# Altium schematic sheet P07 PHY 2.SchDoc
size 420 x 297 mm
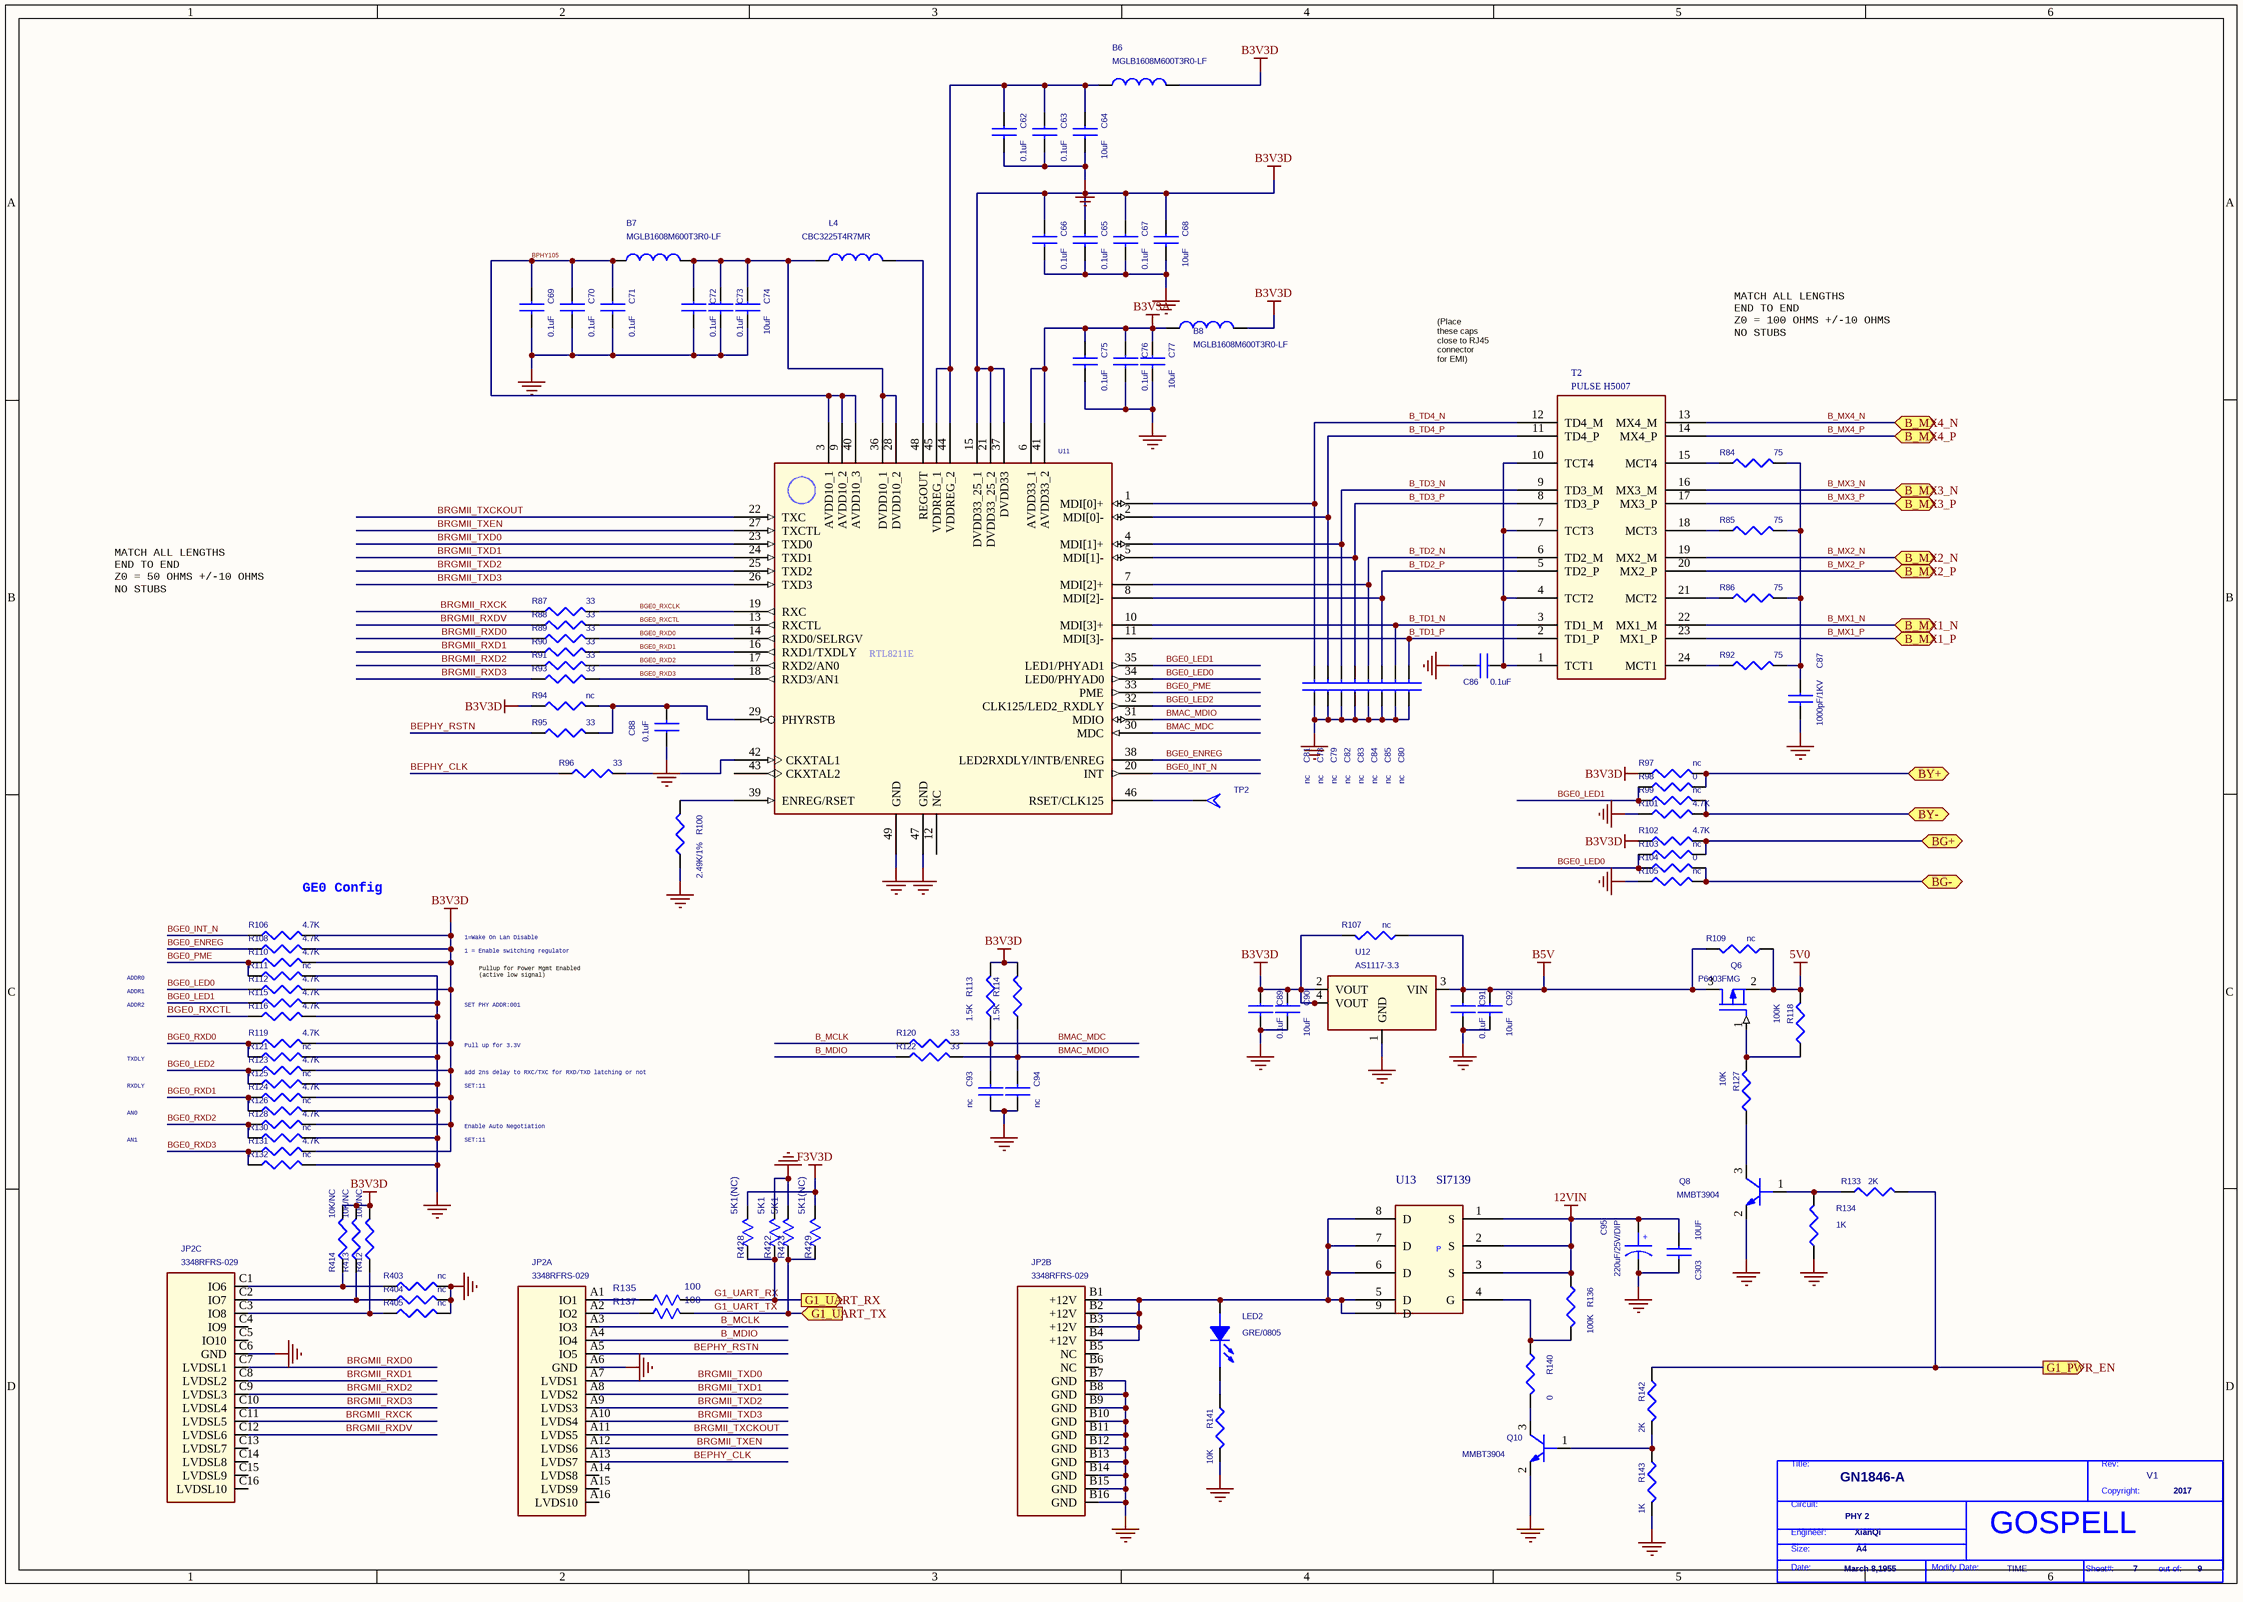
[diagram p0: P07 PHY 2.SchDoc]

## Parts
*  Doc: PHY 2  Page Count: 9  Page Number: 7  Page Create Date: March 8,1955  Page Size: A4  RevCode: V1  Title: GN1846-A  Copyright: 2017  Engineer: XianQi  Page Modify Date: TIME  (hidden comment: GOSPELL)  (graphical)
B6  MGLB1608M600T3R0-LF  [L0603]
B7  MGLB1608M600T3R0-LF  [L0603]
B8  MGLB1608M600T3R0-LF  [L0603]
C62  0.1uF  [0402C]
C63  0.1uF  [0402C]
C64  10uF  [C0603]
C65  0.1uF  [0402C]
C66  0.1uF  [0402C]
C67  0.1uF  [0402C]
C68  10uF  [C0603]
C69  0.1uF  [0402C]
C70  0.1uF  [0402C]
C71  0.1uF  [0402C]
C72  0.1uF  [0402C]
C73  0.1uF  [0402C]
C74  10uF  [C0603]
C75  0.1uF  [0402C]
C76  0.1uF  [0402C]
C77  10uF  [C0603]
C78  nc  [0402C]
C79  nc  [0402C]
C80  nc  [0402C]
C81  nc  [0402C]
C82  nc  [0402C]
C83  nc  [0402C]
C84  nc  [0402C]
C85  nc  [0402C]
C86  0.1uF  [0402C]
C87  1000pF/1KV  [C1206]
C88  0.1uF  [0402C]
C89  0.1uF  [0402C]
C90  10uF  [C0603]
C91  0.1uF  [0402C]
C92  10uF  [C0603]
C93  nc  [0402C]
C94  nc  [0402C]
C95  220uF/25V/DIP  [CE8X3.5]
C303  10UF  [C1206]
JP2  3348RFRS-029  [3348RFRS-029]  (parts A,B,C of 3)
L4  CBC3225T4R7MR  [FB0805]
LED2  GRE/0805  [LED0805]
Q6  P6403FMG  [SOT23]
Q8  MMBT3904  [SOT23]
Q10  MMBT3904  [SOT23]
R84  75  [0402R]
R85  75  [0402R]
R86  75  [0402R]
R87  33  [0402R]
R88  33  [0402R]
R89  33  [0402R]
R90  33  [0402R]
R91  33  [0402R]
R92  75  [0402R]
R93  33  [0402R]
R94  nc  [0402R]
R95  33  [0402R]
R96  33  [0402R]
R97  nc  [0402R]
R98  0  [0402R]
R99  nc  [0402R]
R100  2.49K/1%  [0402R]
R101  4.7K  [0402R]
R102  4.7K  [0402R]
R103  nc  [0402R]
R104  0  [0402R]
R105  nc  [0402R]
R106  4.7K  [0402R]
R107  nc  [R0603]
R108  4.7K  [0402R]
R109  nc  [R0603]
R110  4.7K  [0402R]
R111  nc  [0402R]
R112  4.7K  [0402R]
R113  1.5K  [0402R]
R114  1.5K  [0402R]
R115  4.7K  [0402R]
R116  4.7K  [0402R]
R118  100K  [0402R]
R119  4.7K  [0402R]
R120  33  [0402R]
R121  nc  [0402R]
R122  33  [0402R]
R123  4.7K  [0402R]
R124  4.7K  [0402R]
R125  nc  [0402R]
R126  nc  [0402R]
R127  10K  [0402R]
R128  4.7K  [0402R]
R130  nc  [0402R]
R131  4.7K  [0402R]
R132  nc  [0402R]
R133  2K  [0402R]
R134  1K  [0402R]
R135  100  [0402R]
R136  100K  [R0603]
R137  100  [0402R]
R140  0  [0402R]
R141  10K  [0402R]
R142  2K  [0402R]
R143  1K  [0402R]
R403  nc  [0402R]
R404  nc  [0402R]
R405  nc  [0402R]
R412  10K/NC  [0402R]
R413  10K/NC  [0402R]
R414  10K/NC  [0402R]
R422  5K1  [0402R]
R423  5K1  [0402R]
R428  5K1(NC)  [0402R]
R429  5K1(NC)  [0402R]
T2  PULSE H5007  [H5007-H]
TP2  T POINT A  [TP_G]  (value not drawn)
U11  RTL8211D  [QFN-48P-RTL8211]  (value not drawn)
U12  AS1117-3.3  [SOT223]
U13  SI7139  [PowerPAKSO8]

## Ports
B_MX1_N (bidir), B_MX1_P (bidir), B_MX2_N (bidir), B_MX2_P (bidir), B_MX3_N (bidir), B_MX3_P (bidir), B_MX4_N (bidir), B_MX4_P (bidir), BG+ (bidir), BG- (bidir), BY+ (bidir), BY- (bidir), G1_PWR_EN (out), G1_UART_RX (out), G1_UART_TX (in)

## Nets
5V0: Q6.2(SOURCE) R109.2 R118.1
12VIN: C95.1 C303.1 R136.2 U13.1(S) U13.2(S) U13.3(S)
B3V3A: B8.1 C75.1 C76.1 C77.1 U11.6(AVDD33_1) U11.41(AVDD33_2)
B3V3D: B6.2 B8.2 C65.1 C66.1 C67.1 C68.1 C89.1 C90.1 R94.1 R97.1 R102.1 R106.2 R107.1 R108.2 R110.2 R112.2 R113.2 R114.2 R119.2 R123.2 R124.2 R128.2 R131.2 R412.2 R413.2 R414.2 U11.15(DVDD33_25_1) U11.21(DVDD33_25_2) U11.37(DVDD33) U12.2(VOUT) U12.4(VOUT)
B5V: C91.1 C92.1 Q6.3(DRAIN) R107.2 R109.1 U12.3(VIN)
F3V3D: R428.2(B) R429.2(B)
GND: C62.2 C63.2 C64.2 C65.2 C66.2 C67.2 C68.2 C69.2 C70.2 C71.2 C72.2 C73.2 C74.2 C75.2 C76.2 C77.2 C78.1 C79.1 C80.1 C81.1 C82.1 C83.1 C84.1 C85.1 C86.2 C87.2 C88.1 C89.2 C90.2 C91.2 C92.2 C93.1 C94.1 C95.2 C303.2 JP2.A6(GND) JP2.B7(GND) JP2.B8(GND) JP2.B9(GND) JP2.B10(GND) JP2.B11(GND) JP2.B12(GND) JP2.B13(GND) JP2.B14(GND) JP2.B15(GND) JP2.B16(GND) JP2.C6(GND) Q8.2(EMITTER) Q10.2(EMITTER) R100.1 R101.1 R105.1 R111.2 R115.2 R116.2 R121.2 R125.2 R126.2 R130.2 R132.2 R134.1 R141.1 R143.1 R403.2 R404.2 R405.2 R422.2(B) R423.2(B) U11.47(GND) U11.49(GND) U12.1(GND)
B_MCLK: JP2.A3(IO3) R120.1
B_MDIO: JP2.A4(IO4) R122.1
B_MX1_N: T2.22(MX1_M) ; port B_MX1_N
B_MX1_P: T2.23(MX1_P) ; port B_MX1_P
B_MX2_N: T2.19(MX2_M) ; port B_MX2_N
B_MX2_P: T2.20(MX2_P) ; port B_MX2_P
B_MX3_N: T2.16(MX3_M) ; port B_MX3_N
B_MX3_P: T2.17(MX3_P) ; port B_MX3_P
B_MX4_N: T2.13(MX4_M) ; port B_MX4_N
B_MX4_P: T2.14(MX4_P) ; port B_MX4_P
B_TD1_N: C85.2 T2.3(TD1_M) U11.10(MDI[3]+)
B_TD1_P: C80.2 T2.2(TD1_P) U11.11(MDI[3]-)
B_TD2_N: C83.2 T2.6(TD2_M) U11.7(MDI[2]+)
B_TD2_P: C84.2 T2.5(TD2_P) U11.8(MDI[2]-)
B_TD3_N: C79.2 T2.9(TD3_M) U11.4(MDI[1]+)
B_TD3_P: C82.2 T2.8(TD3_P) U11.5(MDI[1]-)
B_TD4_N: C81.2 T2.12(TD4_M) U11.1(MDI[0]+)
B_TD4_P: C78.2 T2.11(TD4_P) U11.2(MDI[0]-)
BEPHY_CLK: JP2.A13(LVDS7) R96.1
BEPHY_RSTN: JP2.A5(IO5) R95.1
BG+: R102.2 R103.2 ; port BG+
BG-: R104.2 R105.2 ; port BG-
BGE0_ENREG: R108.1 U11.38(LED2RXDLY/INTB/ENREG)
BGE0_INT_N: R106.1 U11.20(INT)
BGE0_LED0: R103.1 R104.1 R112.1 U11.34(LED0/PHYAD0)
BGE0_LED1: R98.1 R99.1 R115.1 U11.35(LED1/PHYAD1)
BGE0_LED2: R123.1 R125.1 U11.32(CLK125/LED2_RXDLY)
BGE0_PME: R110.1 R111.1 U11.33(PME)
BGE0_RXCLK: R87.2 U11.19(RXC)
BGE0_RXCTL: R88.2 R116.1 U11.13(RXCTL)
BGE0_RXD0: R89.2 R119.1 R121.1 U11.14(RXD0/SELRGV)
BGE0_RXD1: R90.2 R124.1 R126.1 U11.16(RXD1/TXDLY)
BGE0_RXD2: R91.2 R128.1 R130.1 U11.17(RXD2/AN0)
BGE0_RXD3: R93.2 R131.1 R132.1 U11.18(RXD3/AN1)
BMAC_MDC: C93.2 R113.1 R120.2 U11.30(MDC)
BMAC_MDIO: C94.2 R114.1 R122.2 U11.31(MDIO)
BPHY105: B7.1 C69.1 C70.1 C71.1 U11.3(AVDD10_1) U11.9(AVDD10_2) U11.40(AVDD10_3)
BRGMII_RXCK: JP2.C11(LVDSL5) R87.1
BRGMII_RXD0: JP2.C7(LVDSL1) R89.1
BRGMII_RXD1: JP2.C8(LVDSL2) R90.1
BRGMII_RXD2: JP2.C9(LVDSL3) R91.1
BRGMII_RXD3: JP2.C10(LVDSL4) R93.1
BRGMII_RXDV: JP2.C12(LVDSL6) R88.1
BRGMII_TXCKOUT: JP2.A11(LVDS5) U11.22(TXC)
BRGMII_TXD0: JP2.A7(LVDS1) U11.23(TXD0)
BRGMII_TXD1: JP2.A8(LVDS2) U11.24(TXD1)
BRGMII_TXD2: JP2.A9(LVDS3) U11.25(TXD2)
BRGMII_TXD3: JP2.A10(LVDS4) U11.26(TXD3)
BRGMII_TXEN: JP2.A12(LVDS6) U11.27(TXCTL)
BY+: R97.2 R98.2 ; port BY+
BY-: R99.2 R101.2 ; port BY-
G1_PWR_EN: R133.2 R142.2 ; port G1_PWR_EN
G1_UART_RX: R135.2(B) R422.1(A) R428.1(A) ; port G1_UART_RX
G1_UART_TX: R137.2(B) R423.1(A) R429.1(A) ; port G1_UART_TX
NetB6_1: B6.1 C62.1 C63.1 C64.1 U11.44(VDDREG_2) U11.45(VDDREG_1)
NetB7_2: B7.2 C72.1 C73.1 C74.1 L4.1 U11.28(DVDD10_2) U11.36(DVDD10_1)
NetC86_1: C86.1 T2.1(TCT1) T2.4(TCT2) T2.7(TCT3) T2.10(TCT4)
NetC87_1: C87.1 R84.2 R85.2 R86.2 R92.2
NetC88_2: C88.2 R94.2 R95.2 U11.29(PHYRSTB)
NetJP2_A1: JP2.A1(IO1) R135.1(A)
NetJP2_A2: JP2.A2(IO2) R137.1(A)
NetJP2_B1: JP2.B1(+12V) JP2.B2(+12V) JP2.B3(+12V) JP2.B4(+12V) LED2.A(ANODE) U13.5(D) U13.6(D) U13.7(D) U13.8(D) U13.9(D)
NetJP2_C1: JP2.C1(IO6) R403.1 R414.1
NetJP2_C2: JP2.C2(IO7) R404.1 R413.1
NetJP2_C3: JP2.C3(IO8) R405.1 R412.1
NetL4_2: L4.2 U11.48(REGOUT)
NetLED2_K: LED2.K(CATHODE) R141.2
NetQ6_1: Q6.1(GATE) R118.2 R127.1
NetQ8_1: Q8.1(BASE) R133.1 R134.2
NetQ8_3: Q8.3(COLLECTOR) R127.2
NetQ10_1: Q10.1(BASE) R142.1 R143.2
NetQ10_3: Q10.3(COLLECTOR) R140.1
NetR84_1: R84.1 T2.15(MCT4)
NetR85_1: R85.1 T2.18(MCT3)
NetR86_1: R86.1 T2.21(MCT2)
NetR92_1: R92.1 T2.24(MCT1)
NetR96_2: R96.2 U11.42(CKXTAL1)
NetR100_2: R100.2 U11.39(ENREG/RSET)
NetR136_1: R136.1 R140.2 U13.4(G)
NetTP2_1: TP2.1(TP) U11.46(RSET/CLK125)

Not connected (* = marked no-connect by the designer): JP2 A14(LVDS8) A15(LVDS9) A16(LVDS10) B5(NC) B6(NC) C4(IO9) C5(IO10) C13(LVDSL7) C14(LVDSL8) C15(LVDSL9) C16(LVDSL10); U11 12(NC) 43(CKXTAL2)

## Notes on the sheet
- (Place
  these caps
  close to RJ45
  connector
  for EMI)
- MATCH ALL LENGTHS
  END TO END
  Z0 = 100 OHMS +/-10 OHMS
  NO STUBS
- MATCH ALL LENGTHS
  END TO END
  Z0 = 50 OHMS +/-10 OHMS
  NO STUBS
- GE0 Config
- 1=Wake On Lan Disable
- ADDR0
- ADDR1
- 1 = Enable switching regulator
- Pullup for Power Mgmt Enabled
  (active low signal)
- ADDR2
- TXDLY
- SET PHY ADDR:001
- Pull up for 3.3V
- add 2ns delay to RXC/TXC for RXD/TXD latching or not
- AN0
- RXDLY
- Enable Auto Negotiation
- SET:11
- AN1
- (in symbol CAP POL) +
- (in symbol GOSPELL) Title:; Rev:; Copyright:; Circuit:; Engineer:; Size:; Date:; Modify Date:; Sheet#:; out of:
- (in symbol RTL8211D_1) RTL8211E
- (in symbol SI7139) P

## Library data of the parts
B6-B8 L4 = CHOKE TORROID_0
C62-C94 = CAP NP_Dup1
C95 = CAP POL
C303 = CAP NP
LED2 = LED_0
Q6 = MOSFET P_0
Q8 Q10 = 2N3904
R84-R106 R108 R110-R116 R119-R126 R128 R130-R132 R136 R140-R143 R403-R405 R412-R414 = R_Dup1
R107 R109 R118 R127 R133 R134 = R
R135 R137 R422 R423 R428 R429 = R_1: PARTS: 1; OriginalSymbolOrigin: (10,20); PINSWAP: (A,B); DEVICE: RK73H1JTTD7502F; PKG_TYPE: SR0603; LEVEL: STD; %208%%161%%192%%224%%195%%251%%179%%198%: 片式厚膜电阻器; COMPONENT_HIGH_MAX: 0.55MM; %215%%232%%214%%181%%212%%202%%208%%237%%198%%171%%178%%238%: +/-1%; %182%%238%%182%%168%%185%%166%%194%%202%(W): 0.1; %195%%232%%202%%246%: 片式厚膜电阻器-0.1W-75000OHM-+/-1%-0603; CODE: 7091238
T2 = PULSE H5007_0
U11 = RTL8211D_1
U12 = AS1117-X_1
* = GOSPELL: Cage Code: 2017; Schematic Page Count: 9; Schematic Page Number: 7